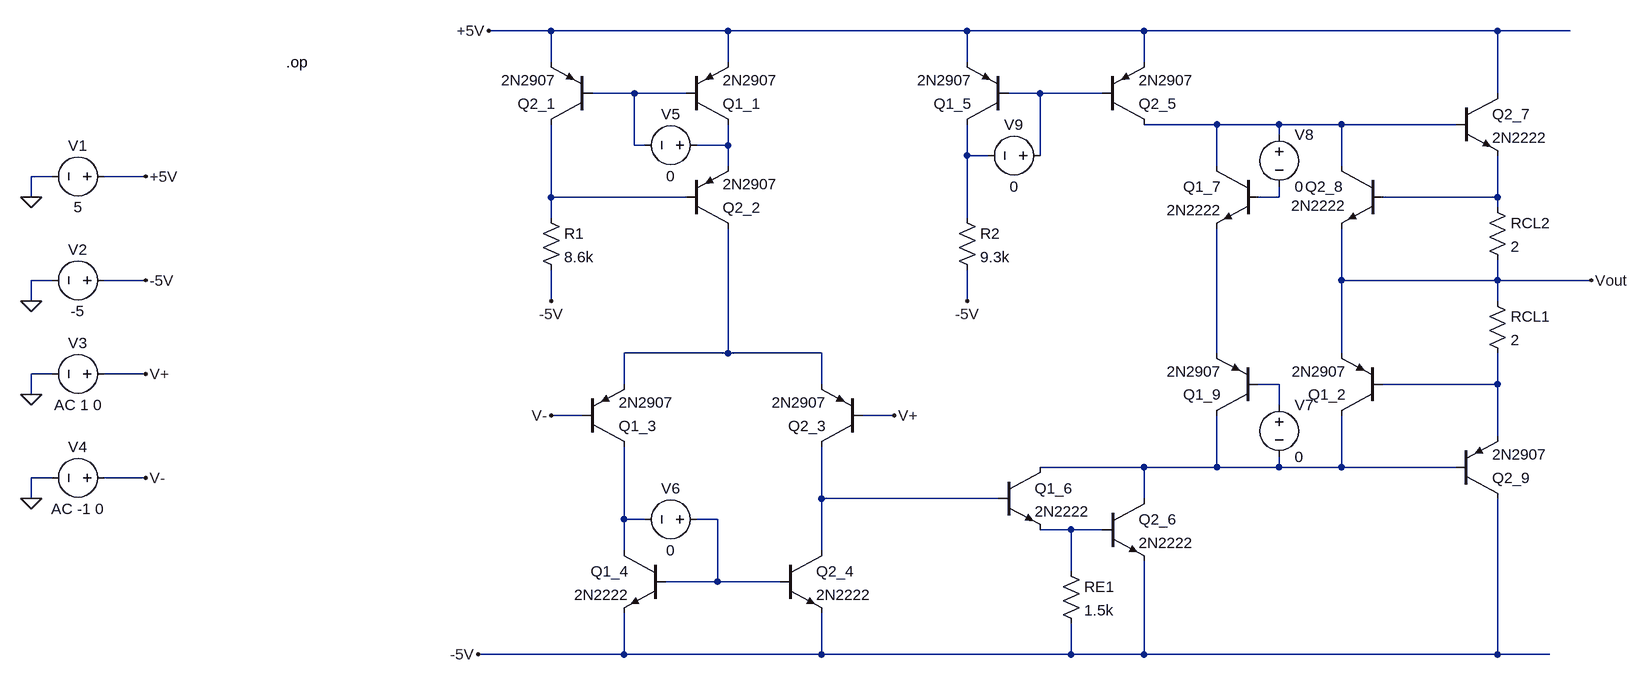
[diagram p0: schematic OP-AMP.asc]
OP-AMP.asc, the LTspice schematic file:
Version 4
SHEET 1 2424 828
WIRE 48 -240 -48 -240
WIRE 320 -240 48 -240
WIRE 688 -240 320 -240
WIRE 960 -240 688 -240
WIRE 1504 -240 960 -240
WIRE 1616 -240 1504 -240
WIRE 48 -192 48 -240
WIRE 320 -192 320 -240
WIRE 688 -192 688 -240
WIRE 960 -192 960 -240
WIRE 176 -144 112 -144
WIRE 256 -144 176 -144
WIRE 800 -144 752 -144
WIRE 896 -144 800 -144
WIRE 1504 -144 1504 -240
WIRE 1072 -96 960 -96
WIRE 1168 -96 1072 -96
WIRE 1264 -96 1168 -96
WIRE 1440 -96 1264 -96
WIRE 1168 -80 1168 -96
WIRE 176 -64 176 -144
WIRE 192 -64 176 -64
WIRE 320 -64 320 -96
WIRE 320 -64 272 -64
WIRE 688 -48 688 -96
WIRE 720 -48 688 -48
WIRE 800 -48 800 -144
WIRE 320 -32 320 -64
WIRE 1072 -32 1072 -96
WIRE 1264 -32 1264 -96
WIRE -720 -16 -752 -16
WIRE -576 -16 -640 -16
WIRE -752 16 -752 -16
WIRE 48 16 48 -96
WIRE 256 16 48 16
WIRE 1168 16 1168 0
WIRE 1168 16 1136 16
WIRE 1504 16 1504 -48
WIRE 1504 16 1328 16
WIRE 1504 32 1504 16
WIRE 48 48 48 16
WIRE 688 48 688 -48
WIRE -720 144 -752 144
WIRE -576 144 -640 144
WIRE 1264 144 1264 64
WIRE 1504 144 1504 112
WIRE 1504 144 1264 144
WIRE 1648 144 1504 144
WIRE -752 176 -752 144
WIRE 48 176 48 128
WIRE 688 176 688 128
WIRE 1504 176 1504 144
WIRE 320 256 320 64
WIRE 320 256 160 256
WIRE 464 256 320 256
WIRE 1072 256 1072 64
WIRE 1264 256 1264 144
WIRE -720 288 -752 288
WIRE -576 288 -640 288
WIRE 160 304 160 256
WIRE 464 304 464 256
WIRE 1168 304 1136 304
WIRE 1504 304 1504 256
WIRE 1504 304 1328 304
WIRE -752 320 -752 288
WIRE 1168 336 1168 304
WIRE 96 352 48 352
WIRE 576 352 528 352
WIRE 1504 384 1504 304
WIRE 960 432 800 432
WIRE 1072 432 1072 352
WIRE 1072 432 960 432
WIRE 1168 432 1168 416
WIRE 1168 432 1072 432
WIRE 1264 432 1264 352
WIRE 1264 432 1168 432
WIRE 1440 432 1264 432
WIRE -720 448 -752 448
WIRE -576 448 -640 448
WIRE -752 480 -752 448
WIRE 464 480 464 400
WIRE 736 480 464 480
WIRE 960 480 960 432
WIRE 160 512 160 400
WIRE 192 512 160 512
WIRE 304 512 272 512
WIRE 848 528 800 528
WIRE 896 528 848 528
WIRE 160 560 160 512
WIRE 464 560 464 480
WIRE 848 592 848 528
WIRE 304 608 304 512
WIRE 304 608 224 608
WIRE 400 608 304 608
WIRE 160 720 160 656
WIRE 160 720 -64 720
WIRE 464 720 464 656
WIRE 464 720 160 720
WIRE 848 720 848 672
WIRE 848 720 464 720
WIRE 960 720 960 576
WIRE 960 720 848 720
WIRE 1504 720 1504 480
WIRE 1504 720 960 720
WIRE 1584 720 1504 720
FLAG 576 352 V+
FLAG 48 352 V-
FLAG -576 -16 +5V
FLAG -576 144 -5V
FLAG -576 288 V+
FLAG -752 320 0
FLAG -752 176 0
FLAG -752 16 0
FLAG 48 176 -5V
FLAG -576 448 V-
FLAG -752 480 0
FLAG 688 176 -5V
FLAG 1648 144 Vout
FLAG -64 720 -5V
FLAG -48 -240 +5V
SYMBOL pnp 96 400 M180
SYMATTR InstName Q1_3
SYMATTR Value 2N2907
SYMBOL pnp 528 400 R180
SYMATTR InstName Q2_3
SYMATTR Value 2N2907
SYMBOL voltage -624 -16 R90
WINDOW 0 -32 56 VBottom 2
WINDOW 3 32 56 VTop 2
SYMATTR InstName V1
SYMATTR Value 5
SYMBOL voltage -624 144 R90
WINDOW 0 -32 56 VBottom 2
WINDOW 3 32 56 VTop 2
SYMATTR InstName V2
SYMATTR Value -5
SYMBOL voltage -624 288 R90
WINDOW 0 -32 56 VBottom 2
WINDOW 3 32 56 VTop 2
SYMATTR InstName V3
SYMATTR Value AC 1 0
SYMBOL pnp 256 64 M180
SYMATTR InstName Q2_2
SYMATTR Value 2N2907
SYMBOL pnp 256 -96 M180
SYMATTR InstName Q1_1
SYMATTR Value 2N2907
SYMBOL pnp 112 -96 R180
SYMATTR InstName Q2_1
SYMATTR Value 2N2907
SYMBOL res 32 32 R0
SYMATTR InstName R1
SYMATTR Value 8.6k
SYMBOL npn 224 560 M0
SYMATTR InstName Q1_4
SYMATTR Value 2N2222
SYMBOL npn 400 560 R0
SYMATTR InstName Q2_4
SYMATTR Value 2N2222
SYMBOL voltage -624 448 R90
WINDOW 0 -32 56 VBottom 2
WINDOW 3 32 56 VTop 2
SYMATTR InstName V4
SYMATTR Value AC -1 0
SYMBOL pnp 752 -96 R180
SYMATTR InstName Q1_5
SYMATTR Value 2N2907
SYMBOL pnp 896 -96 M180
SYMATTR InstName Q2_5
SYMATTR Value 2N2907
SYMBOL res 672 32 R0
SYMATTR InstName R2
SYMATTR Value 9.3k
SYMBOL npn 896 480 R0
SYMATTR InstName Q2_6
SYMATTR Value 2N2222
SYMBOL npn 736 432 R0
SYMATTR InstName Q1_6
SYMATTR Value 2N2222
SYMBOL res 832 576 R0
SYMATTR InstName RE1
SYMATTR Value 1.5k
SYMBOL res 1488 160 R0
SYMATTR InstName RCL1
SYMATTR Value 2
SYMBOL res 1488 16 R0
SYMATTR InstName RCL2
SYMATTR Value 2
SYMBOL npn 1328 -32 M0
WINDOW 0 61 32 Left 2
WINDOW 3 57 61 Left 2
SYMATTR InstName Q2_8
SYMATTR Value 2N2222
SYMBOL npn 1440 -144 R0
SYMATTR InstName Q2_7
SYMATTR Value 2N2222
SYMBOL npn 1136 -32 M0
SYMATTR InstName Q1_7
SYMATTR Value 2N2222
SYMBOL pnp 1328 352 R180
SYMATTR InstName Q1_2
SYMATTR Value 2N2907
SYMBOL pnp 1136 352 R180
SYMATTR InstName Q1_9
SYMATTR Value 2N2907
SYMBOL pnp 1440 480 M180
SYMATTR InstName Q2_9
SYMATTR Value 2N2907
SYMBOL voltage 288 -64 R90
WINDOW 0 -32 56 VBottom 2
WINDOW 3 32 56 VTop 2
SYMATTR InstName V5
SYMATTR Value 0
SYMBOL voltage 288 512 R90
WINDOW 0 -32 56 VBottom 2
WINDOW 3 32 56 VTop 2
SYMATTR InstName V6
SYMATTR Value 0
SYMBOL voltage 1168 320 R0
SYMATTR InstName V7
SYMATTR Value 0
SYMBOL voltage 1168 -96 R0
WINDOW 123 0 0 Left 0
WINDOW 39 0 0 Left 0
SYMATTR InstName V8
SYMATTR Value 0
SYMBOL voltage 816 -48 R90
WINDOW 0 -32 56 VBottom 2
WINDOW 3 32 56 VTop 2
SYMATTR InstName V9
SYMATTR Value 0
TEXT -360 -192 Left 2 !.op

The netlist it stands for:
* OP-AMP.asc
Q1_3 N015 V- N009 0 2N2907
Q2_3 N014 V+ N009 0 2N2907
V1 +5V 0 5
V2 -5V 0 -5
V3 V+ 0 AC 1 0
Q2_2 N009 N006 N004 0 2N2907
Q1_1 N004 N001 +5V 0 2N2907
Q2_1 N006 N001 +5V 0 2N2907
R1 N006 -5V 8.6k
Q1_4 N015 N016 -5V 0 2N2222
Q2_4 N014 N016 -5V 0 2N2222
V4 V- 0 AC -1 0
Q1_5 N005 N002 +5V 0 2N2907
Q2_5 N003 N002 +5V 0 2N2907
R2 N005 -5V 9.3k
Q2_6 N013 N017 -5V 0 2N2222
Q1_6 N013 N014 N017 0 2N2222
RE1 N017 -5V 1.5k
RCL1 Vout N012 2
RCL2 N008 Vout 2
Q2_8 N003 N008 Vout 0 2N2222
Q2_7 +5V N003 N008 0 2N2222
Q1_7 N003 N007 N010 0 2N2222
Q1_2 N013 N012 Vout 0 2N2907
Q1_9 N013 N011 N010 0 2N2907
Q2_9 -5V N013 N012 0 2N2907
V5 N004 N001 0
V6 N016 N015 0
V7 N011 N013 0
V8 N003 N007 0
V9 N002 N005 0
.model NPN NPN
.model PNP PNP
.lib standard.bjt
.op
.backanno
.end